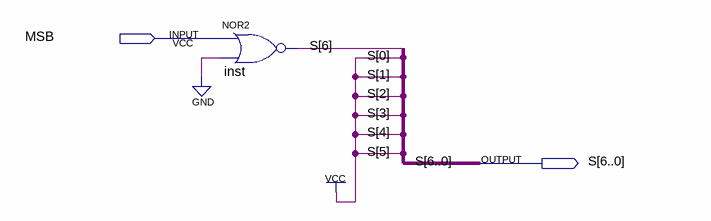
[diagram p0: schematic sheet]
// Quartus schematic displaynegativo.bdf as structural Verilog: 1 symbols, 2 pins
module displaynegativo (
  input  MSB,
  output [6:0] S
);

  nor inst (S[6], MSB, 1'b0);

  assign S[5:0] = {6{1'b1}};
endmodule
